# Altium project control proj.PrjPcb
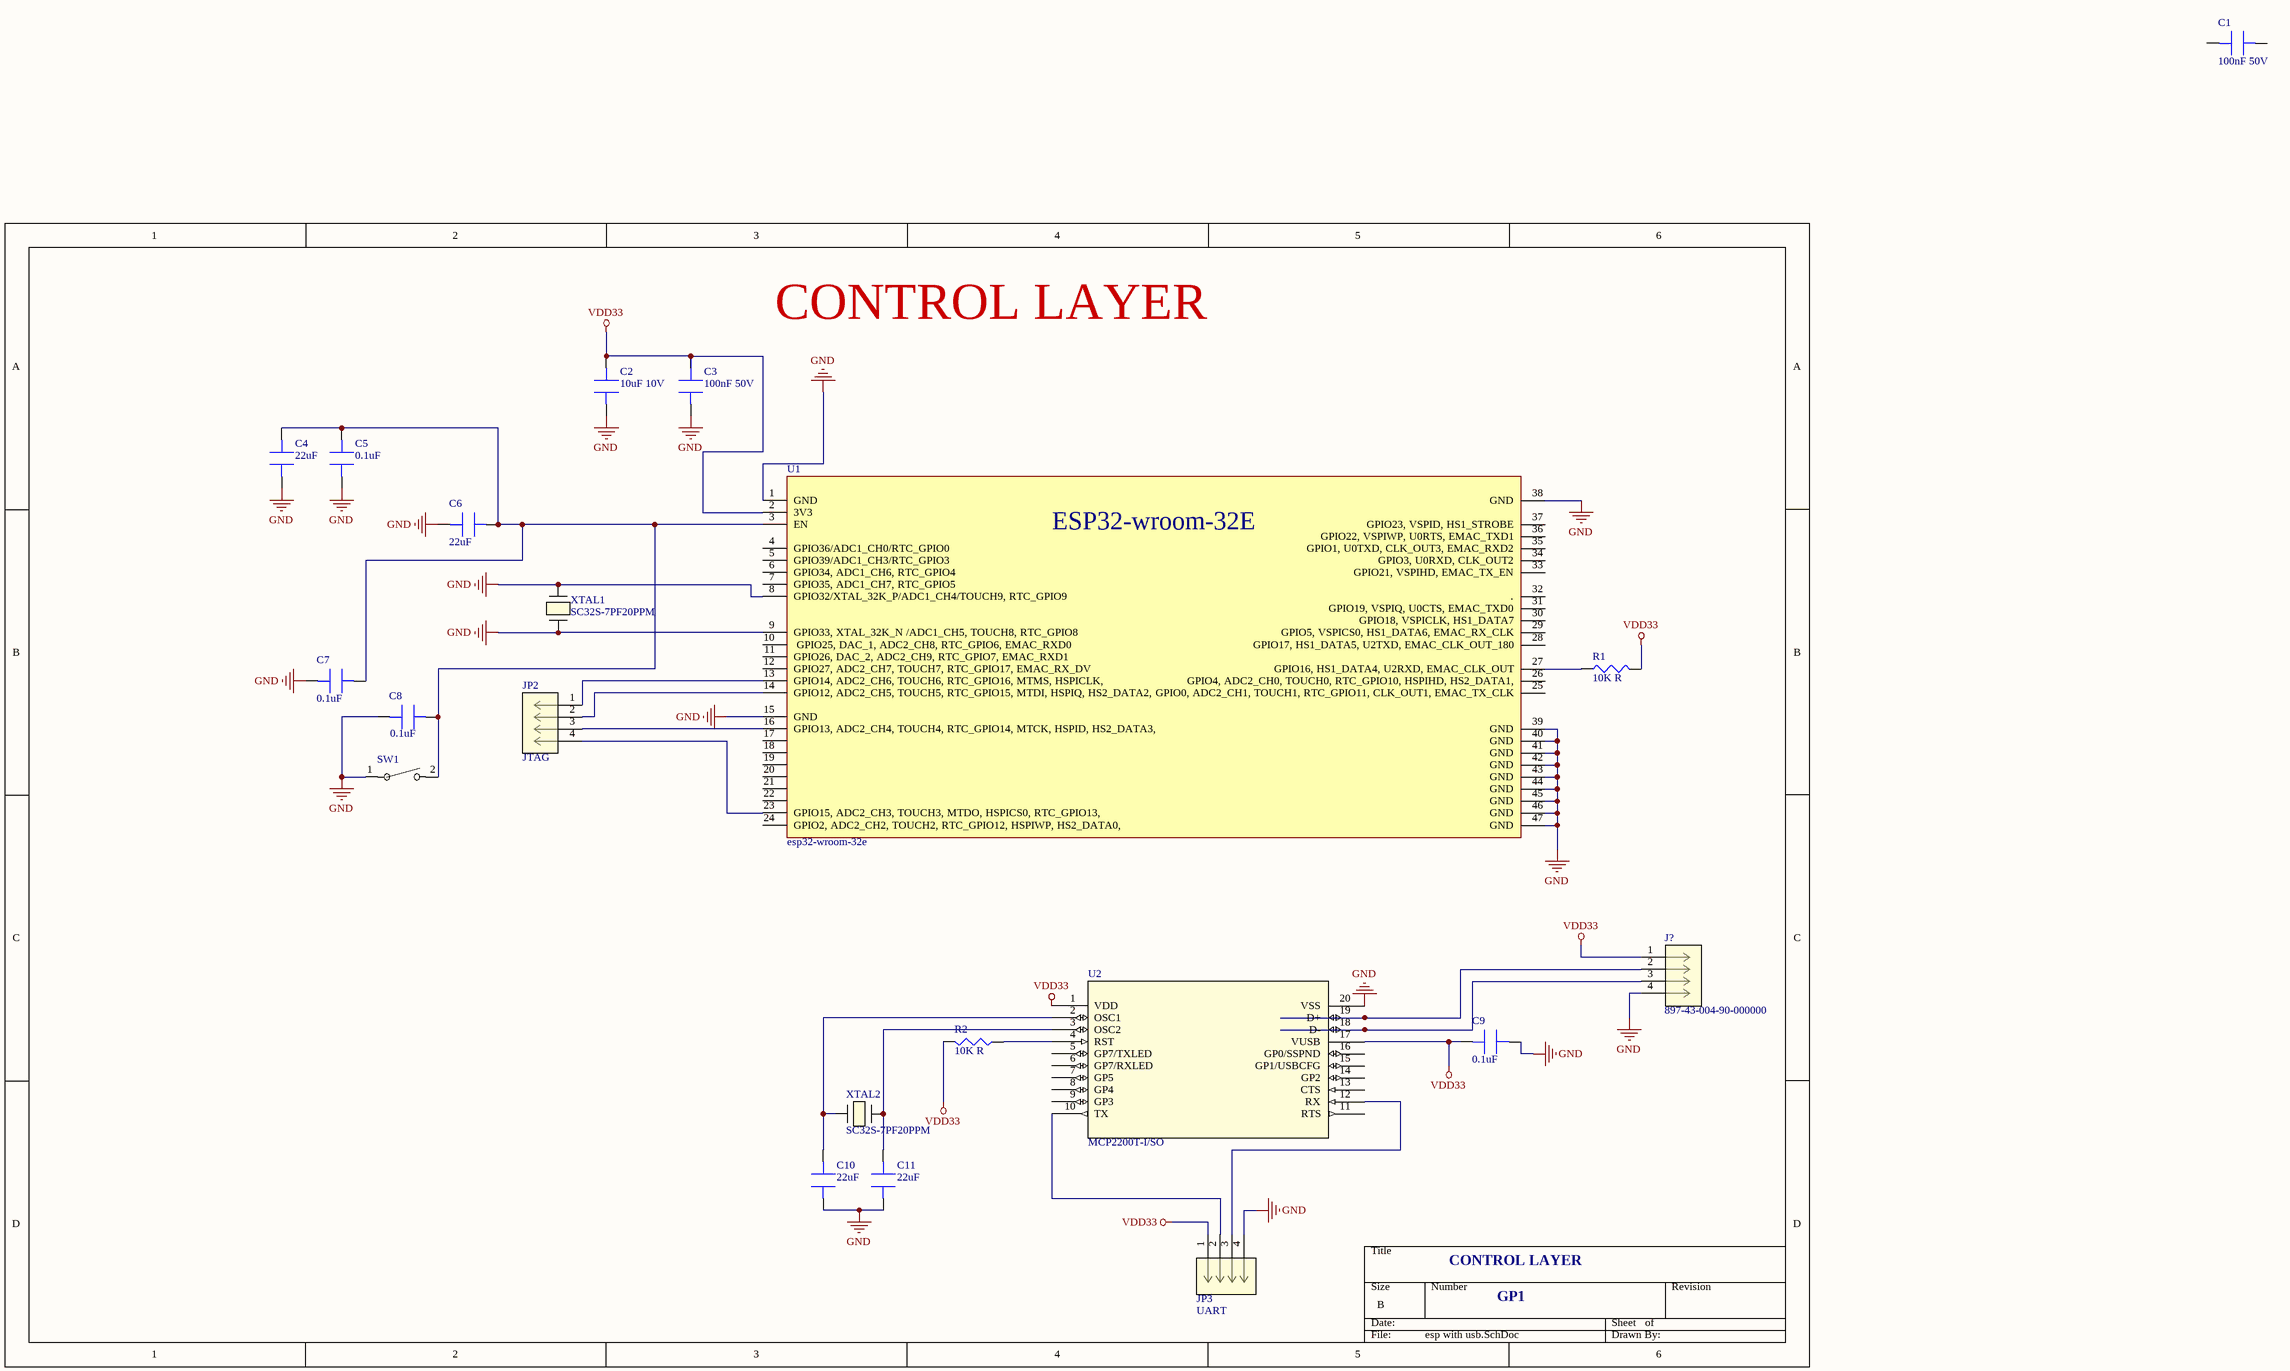
[diagram p0: esp with usb.SchDoc]
1 sheet, 21 parts. Net scope: global (net labels, ports and power ports of the same name join across sheets).
Board file: PCB1-esp with usb.PcbDoc

## Sheet esp with usb.SchDoc
size B; SheetNumber: 1; SheetTotal: 1

### Parts
C1  100nF 50V
C2  10uF 10V
C3  100nF 50V
C4  22uF  [PCBComponent_1]
C5  0.1uF
C6  22uF  [PCBComponent_1]
C7  0.1uF
C8  0.1uF
C9  0.1uF
C10  22uF  [PCBComponent_1]
C11  22uF  [PCBComponent_1]
J?  897-43-004-90-000000  [CONN_897-43-004-90-000000_MIM]
JP2  JTAG  [CONN_2078430004-SD_04_MOL]
JP3  UART  [CONN_2078430004-SD_04_MOL]
R1  10K R  [R0805]
R2  10K R  [R0805]
SW1  MDPSLFS  [SW_MDPSLFS_CNK]  (value not drawn)
U1  esp32-wroom-32e
U2  MCP2200T-I/SO  [SOIC20_SO_MCH]
XTAL1  SC32S-7PF20PPM  [XTAL_SC32S-7PF20PPM_EPS]
XTAL2  SC32S-7PF20PPM  [XTAL_SC32S-7PF20PPM_EPS]

### Nets
GND: C2.1 C3.1 C4.1 C5.1 C6.1 C7.1 C8.1 C9.1 C10.1 C11.1 J?.4 JP3.4 SW1.1 U1.1(GND) U1.8(GPIO32/XTAL_32K_P/ADC1_CH4/TOUCH9,_RTC_GPIO9) U1.9(GPIO33,_XTAL_32K_N_/ADC1_CH5,_TOUCH8,_RTC_GPIO8) U1.15(GND) U1.38(GND) U1.39(GND) U1.40(GND) U1.41(GND) U1.42(GND) U1.43(GND) U1.44(GND) U1.45(GND) U1.46(GND) U1.47(GND) U2.20(VSS) XTAL1.1 XTAL1.2
VDD33: C2.2 C3.2 C9.2 J?.1 JP3.1 R1.2 R2.2 U1.2(3V3) U2.1(VDD) U2.17(VUSB)
NetC4_2: C4.2 C5.2 C6.2 C7.2 C8.2 SW1.2 U1.3(EN)
NetC10_2: C10.2 U2.2(OSC1) XTAL2.2
NetC11_2: C11.2 U2.3(OSC2) XTAL2.1
NetJ?_2: J?.2 U2.19(D+)
NetJ?_3: J?.3 U2.18(D-)
NetJP2_1: JP2.1 U1.13(GPIO14,_ADC2_CH6,_TOUCH6,_RTC_GPIO16,_MTMS,_HSPICLK,)
NetJP2_2: JP2.2 U1.14(GPIO12,_ADC2_CH5,_TOUCH5,_RTC_GPIO15,_MTDI,_HSPIQ,_HS2_DATA2,)
NetJP2_3: JP2.3 U1.16(GPIO13,_ADC2_CH4,_TOUCH4,_RTC_GPIO14,_MTCK,_HSPID,_HS2_DATA3,)
NetJP2_4: JP2.4 U1.23(GPIO15,_ADC2_CH3,_TOUCH3,_MTDO,_HSPICS0,_RTC_GPIO13,)
NetJP3_2: JP3.2 U2.10(TX)
NetJP3_3: JP3.3 U2.12(RX)
NetR1_1: R1.1 U1.27(GPIO16,_HS1_DATA4,_U2RXD,_EMAC_CLK_OUT)
NetR2_1: R2.1 U2.4(RST)

Not connected (* = marked no-connect by the designer): C1 1 2; U1 4(GPIO36/ADC1_CH0/RTC_GPIO0) 5(GPIO39/ADC1_CH3/RTC_GPIO3) 6(GPIO34,_ADC1_CH6,_RTC_GPIO4) 7(GPIO35,_ADC1_CH7,_RTC_GPIO5) 10(_GPIO25,_DAC_1,_ADC2_CH8,_RTC_GPIO6,_EMAC_RXD0) 11(GPIO26,_DAC_2,_ADC2_CH9,_RTC_GPIO7,_EMAC_RXD1) 12(GPIO27,_ADC2_CH7,_TOUCH7,_RTC_GPIO17,_EMAC_RX_DV) 17 18 19 20 21 22 24(GPIO2,_ADC2_CH2,_TOUCH2,_RTC_GPIO12,_HSPIWP,_HS2_DATA0,) 25(GPIO0,_ADC2_CH1,_TOUCH1,_RTC_GPIO11,_CLK_OUT1,_EMAC_TX_CLK) 26(GPIO4,_ADC2_CH0,_TOUCH0,_RTC_GPIO10,_HSPIHD,_HS2_DATA1,) 28(GPIO17,_HS1_DATA5,_U2TXD,_EMAC_CLK_OUT_180) 29(GPIO5,_VSPICS0,_HS1_DATA6,_EMAC_RX_CLK) 30(GPIO18,_VSPICLK,_HS1_DATA7) 31(GPIO19,_VSPIQ,_U0CTS,_EMAC_TXD0) 32(.) 33(GPIO21,_VSPIHD,_EMAC_TX_EN) 34(GPIO3,_U0RXD,_CLK_OUT2) 35(GPIO1,_U0TXD,_CLK_OUT3,_EMAC_RXD2) 36(GPIO22,_VSPIWP,_U0RTS,_EMAC_TXD1) 37(GPIO23,_VSPID,_HS1_STROBE); U2 5(GP7/TXLED) 6(GP7/RXLED) 7(GP5) 8(GP4) 9(GP3) 11(RTS) 13(CTS) 14(GP2) 15(GP1/USBCFG) 16(GP0/SSPND)

### Notes on the sheet
- CONTROL LAYER
- GP1
- (in symbol ESP32-WROOM-32E-N8) ESP32-wroom-32E

### Library data of the parts
C1 C3 = CL05B104KB54PNC: 50V 100nF X7R ±10% 0402 Multilayer Ceramic Capacitors MLCC - SMD/SMT ROHS; Manufacturer: Samsung Electro-Mechanics; ESC PART NUMBER: C307331; Supplier: Avnet; Supplier Part Number: CL05B104KB54PNC; Manufacturer Part Number: CL05B104KB54PNC; RoHS: Compliant; Category: Ceramic Capacitors; Stock: 50000; Pricing: 10000=0.00505, 20000=0.00502, 40000=0.005, 60000=0.00497, 80000=0.00494 (USD); Value: 100nF; Case/Package: 0402; China RoHS: Compliant; Dielectric Material: Ceramic; Height: 500µm; Length: 1mm; Lifecycle Status: Production; Material: Ceramic; Max Operating Temperature: 125°C; Min Operating Temperature: -55°C; Mounting Technology: Surface Mount; Number of Terminals: 2; REACH SVHC: Yes; Schedule B: 8532240020, 8532240020|8532240020|8532240020|8532240020|8532240020|8532240020|8532240020|8532240020|8532240020|8532240020|8532240020|8532240020|8532240020|8532240020|8532240020|8532240020|8532240020|8532240020|8532240020|8532240020|8532240020|8532240020|8532240020|85; Tolerance: 10%; Voltage Rating: 50V; Voltage Rating (DC): 50V; Width: 500µm; ComponentLink1URL: https://datasheet.octopart.com:443/CL05B104KB54PNC-Samsung-Electro-Mechanics-datasheet-182018727.pdf?src-supplier=IHS; ComponentLink1Description: https://datasheet.octopart.com:443/CL05B104KB54PNC-Samsung-Electro-Mechanics-datasheet-182018727.pdf?src-supplier=IHS; ComponentLink2URL: https://datasheet.octopart.com:443/CL05B104KB54PNC-Samsung-Electro-Mechanics-datasheet-138685816.pdf?src-supplier=Samsung+SCT; ComponentLink2Description: https://datasheet.octopart.com:443/CL05B104KB54PNC-Samsung-Electro-Mechanics-datasheet-138685816.pdf?src-supplier=Samsung+SCT; ComponentLink3URL: https://datasheet.octopart.com:443/CL05B104KB54PNC-Samsung-datasheet-8326407.pdf?src-supplier=TME; ComponentLink3Description: https://datasheet.octopart.com:443/CL05B104KB54PNC-Samsung-datasheet-8326407.pdf?src-supplier=TME
C2 = CL05B104KB54PNC (2): 50V 100nF X7R ±10% 0402 Multilayer Ceramic Capacitors MLCC - SMD/SMT ROHS; Manufacturer: Samsung Electro-Mechanics; ESC PART NUMBER: C307415; Supplier: Avnet; Supplier Part Number: CL05B104KB54PNC; Manufacturer Part Number: CL05B104KB54PNC; RoHS: Compliant; Category: Ceramic Capacitors; Stock: 50000; Pricing: 10000=0.00505, 20000=0.00502, 40000=0.005, 60000=0.00497, 80000=0.00494 (USD); Value: 100nF; Case/Package: 0402; China RoHS: Compliant; Dielectric Material: Ceramic; Height: 500µm; Length: 1mm; Lifecycle Status: Production; Material: Ceramic; Max Operating Temperature: 125°C; Min Operating Temperature: -55°C; Mounting Technology: Surface Mount; Number of Terminals: 2; REACH SVHC: Yes; Schedule B: 8532240020, 8532240020|8532240020|8532240020|8532240020|8532240020|8532240020|8532240020|8532240020|8532240020|8532240020|8532240020|8532240020|8532240020|8532240020|8532240020|8532240020|8532240020|8532240020|8532240020|8532240020|8532240020|8532240020|8532240020|85; Tolerance: 10%; Voltage Rating: 50V; Voltage Rating (DC): 50V; Width: 500µm; ComponentLink1URL: https://datasheet.octopart.com:443/CL05B104KB54PNC-Samsung-Electro-Mechanics-datasheet-182018727.pdf?src-supplier=IHS; ComponentLink1Description: https://datasheet.octopart.com:443/CL05B104KB54PNC-Samsung-Electro-Mechanics-datasheet-182018727.pdf?src-supplier=IHS; ComponentLink2URL: https://datasheet.octopart.com:443/CL05B104KB54PNC-Samsung-Electro-Mechanics-datasheet-138685816.pdf?src-supplier=Samsung+SCT; ComponentLink2Description: https://datasheet.octopart.com:443/CL05B104KB54PNC-Samsung-Electro-Mechanics-datasheet-138685816.pdf?src-supplier=Samsung+SCT; ComponentLink3URL: https://datasheet.octopart.com:443/CL05B104KB54PNC-Samsung-datasheet-8326407.pdf?src-supplier=TME; ComponentLink3Description: https://datasheet.octopart.com:443/CL05B104KB54PNC-Samsung-datasheet-8326407.pdf?src-supplier=TME
C4 C10 C11 = CAP22UF
C5 C7-C9 = CL05A104KA5NNNC: 25V 100nF X5R ±10% 0402 Multilayer Ceramic Capacitors MLCC - SMD/SMT ROHS; Manufacturer: Samsung Electro-Mechanics; Supplier: Avnet; Supplier Part Number: CL05A104KA5NNNC; Manufacturer Part Number: CL05A104KA5NNNC; RoHS: Compliant; Category: Ceramic Capacitors; Stock: 6250000; Pricing: 10000=0.00127, 20000=0.00127, 40000=0.00126, 60000=0.00126, 80000=0.00125 (USD); Value: 100nF; Case/Package: 0402; Case Code (Imperial): 0402; Case Code (Metric): 1005; China RoHS: Compliant; Depth: 500µm; Dielectric: X5R; Dielectric Material: Ceramic; Height: 500µm; Lead Free: Lead Free; Length: 1mm; Lifecycle Status: Production; Material: Ceramic; Max Operating Temperature: 85°C; Min Operating Temperature: -55°C; Mounting Technology: Surface Mount; Number of Terminals: 2; Radiation Hardening: No; REACH SVHC: Yes; Schedule B: 8532240020, 8532240020|8532240020|8532240020|8532240020|8532240020|8532240020|8532240020|8532240020|8532240020|8532240020|8532240020|8532240020|8532240020|8532240020|8532240020|8532240020|8532240020|8532240020|8532240020|8532240020|8532240020|8532240020|8532240020|85; Thickness: 558.8µm; Tolerance: 10%; Voltage: 25V; Voltage Rating: 25V; Voltage Rating (DC): 25V; Width: 500µm; ComponentLink1URL: https://datasheet.octopart.com:443/CL05A104KA5NNNC-Samsung-Electro-Mechanics-datasheet-181960513.pdf?src-supplier=Newark; ComponentLink1Description: https://datasheet.octopart.com:443/CL05A104KA5NNNC-Samsung-Electro-Mechanics-datasheet-181960513.pdf?src-supplier=Newark; ComponentLink2URL: https://datasheet.octopart.com:443/CL05A104KA5NNNC-Samsung-Electro-Mechanics-datasheet-136031715.pdf?src-supplier=Samsung+SCT; ComponentLink2Description: https://datasheet.octopart.com:443/CL05A104KA5NNNC-Samsung-Electro-Mechanics-datasheet-136031715.pdf?src-supplier=Samsung+SCT; ComponentLink3URL: https://datasheet.octopart.com:443/CL05A104KA5NNNC-Samsung-Electro-Mechanics-datasheet-110226196.pdf?src-supplier=Future+Electronics; ComponentLink3Description: https://datasheet.octopart.com:443/CL05A104KA5NNNC-Samsung-Electro-Mechanics-datasheet-110226196.pdf?src-supplier=Future+Electronics; ComponentLink4URL: https://datasheet.octopart.com:443/CL05A104KA5NNNC-Samsung-Electro-Mechanics-datasheet-81461585.pdf?src-supplier=Future+Electronics; ComponentLink4Description: https://datasheet.octopart.com:443/CL05A104KA5NNNC-Samsung-Electro-Mechanics-datasheet-81461585.pdf?src-supplier=Future+Electronics; ComponentLink5URL: https://datasheet.octopart.com:443/CL05A104KA5NNNC-Samsung-datasheet-42485115.pdf?src-supplier=Future+Electronics; ComponentLink5Description: https://datasheet.octopart.com:443/CL05A104KA5NNNC-Samsung-datasheet-42485115.pdf?src-supplier=Future+Electronics; ComponentLink6URL: https://datasheet.octopart.com:443/CL05A104KA5NNNC-Samsung-datasheet-26588998.pdf?src-supplier=Future+Electronics; ComponentLink6Description: https://datasheet.octopart.com:443/CL05A104KA5NNNC-Samsung-datasheet-26588998.pdf?src-supplier=Future+Electronics; ComponentLink7URL: https://datasheet.octopart.com:443/CL05A104KA5NNNC-Samsung-datasheet-12539701.pdf?src-supplier=Future+Electronics; ComponentLink7Description: https://datasheet.octopart.com:443/CL05A104KA5NNNC-Samsung-datasheet-12539701.pdf?src-supplier=Future+Electronics; ComponentLink8URL: https://datasheet.octopart.com:443/CL05A104KA5NNNC-Samsung-Electro-Mechanics-datasheet-149136628.pdf?src-supplier=Future+Electronics; ComponentLink8Description: https://datasheet.octopart.com:443/CL05A104KA5NNNC-Samsung-Electro-Mechanics-datasheet-149136628.pdf?src-supplier=Future+Electronics; ComponentLink9URL: https://datasheet.octopart.com/CL05A104KA5NNNC-Samsung-Electro-Mechanics-datasheet-97040617.pdf; ComponentLink9Description: https://datasheet.octopart.com/CL05A104KA5NNNC-Samsung-Electro-Mechanics-datasheet-97040617.pdf; ComponentLink10URL: https://datasheet.octopart.com/CL05A104KA5NNNC-Samsung-Electro-Mechanics-datasheet-8324245.pdf; ComponentLink10Description: https://datasheet.octopart.com/CL05A104KA5NNNC-Samsung-Electro-Mechanics-datasheet-8324245.pdf; ComponentLink11URL: https://datasheet.octopart.com/General-Multilayer-Ceramic-Capacitors-Samsung-datasheet-family-111.pdf; ComponentLink11Description: https://datasheet.octopart.com/General-Multilayer-Ceramic-Capacitors-Samsung-datasheet-family-111.pdf; ComponentLink12URL: https://datasheet.octopart.com:443/CL05A104KA5NNNC-Samsung-Electro-Mechanics-datasheet-11550168.pdf?src-supplier=Arrow+Electronics; ComponentLink12Description: https://datasheet.octopart.com:443/CL05A104KA5NNNC-Samsung-Electro-Mechanics-datasheet-11550168.pdf?src-supplier=Arrow+Electronics; ComponentLink13URL: https://datasheet.octopart.com:443/CL05A104KA5NNNC-Samsung-datasheet-59220082.pdf?src-supplier=TME; ComponentLink13Description: https://datasheet.octopart.com:443/CL05A104KA5NNNC-Samsung-datasheet-59220082.pdf?src-supplier=TME; ComponentLink14URL: http://sigma.octopart.com:80/rohs_certificate/General-Multilayer-Ceramic-Capacitors-Samsung-family-110.pdf?src-supplier=Compliance+Statements; ComponentLink14Description: http://sigma.octopart.com:80/rohs_certificate/General-Multilayer-Ceramic-Capacitors-Samsung-family-110.pdf?src-supplier=Compliance+Statements; ComponentLink15URL: http://sigma.octopart.com:80/rohs_statement/General-Multilayer-Ceramic-Capacitors-Samsung-family-132.pdf?src-supplier=Compliance+Statements; ComponentLink15Description: http://sigma.octopart.com:80/rohs_statement/General-Multilayer-Ceramic-Capacitors-Samsung-family-132.pdf?src-supplier=Compliance+Statements; ComponentLink16URL: http://sigma.octopart.com:80/reach_statement/General-Multilayer-Ceramic-Capacitors-Samsung-family-133.pdf?src-supplier=Compliance+Statements; ComponentLink16Description: http://sigma.octopart.com:80/reach_statement/General-Multilayer-Ceramic-Capacitors-Samsung-family-133.pdf?src-supplier=Compliance+Statements; LCSC PART NUMBER: *
C6 = CAP22pF
J? = 897-43-004-90-000000: No Description Available; Manufacturer_Name: Mill-Max; Copyright: Copyright (C) 2025 Ultra Librarian. All rights reserved.; Manufacturer_Part_Number: 897-43-004-90-000000; RefDes: RefDes; Type: Type
JP2 JP3 = 2078430004: KK Plus 250 Header, 2.50mm Pitch, Vertical, Fully Shrouded, Tin (Sn) Plating, 4 Circuits, with Peg, Glow-Wire Capable; Manufacturer_Name: Molex Connector Corporation; Copyright: Copyright (C) 2025 Ultra Librarian. All rights reserved.; Manufacturer_Part_Number: 2078430004; RefDes: RefDes; Type: Type
R1 R2 = RESSS
SW1 = MDPSLFS: Description; Manufacturer_Name: C&K Components; Type: Pushbutton Switches; Copyright: Copyright (C) 2025 Ultra Librarian. All rights reserved.; Manufacturer_Part_Number: MDPSLFS
U1 = ESP32-WROOM-32E-N8: SMD module, ESP32-D0WD-V3, ESP32 ECO V3, 8 MB SPI flash, PCB antenna; Manufacturer: Espressif Systems; Max Supply Voltage: 3.6V; Min Supply Voltage: 3V; Operating Supply Voltage: 3.3V; Supplier: DigiKey; Supplier Part Number: 5407-ESP32-WROOM-32E-N8CT-ND; Manufacturer Part Number: ESP32-WROOM-32E-N8; RoHS: Compliant; Category: System on Chip (SoC); Stock: 5737; Pricing: 1=5.28, 10=4.566, 25=4.3196, 100=3.9802, 250=3.7768 (USD); Height - Seated (Max): 3.25mm; Length: 25.5mm; Max Operating Temperature: 85°C; Min Operating Temperature: -40°C; Number of Terminals: 38; REACH SVHC: Yes; Terminal Pitch: 1.27mm; Width: 18mm; ComponentLink1URL: https://datasheet.octopart.com:443/ESP32-WROOM-32E-N8-Espressif-Systems-datasheet-182247776.pdf?src-supplier=IHS; ComponentLink1Description: https://datasheet.octopart.com:443/ESP32-WROOM-32E-N8-Espressif-Systems-datasheet-182247776.pdf?src-supplier=IHS; ComponentLink2URL: https://datasheet.octopart.com:443/ESP32-WROOM-32E-N8-Espressif-Systems-datasheet-188867343.pdf?src-supplier=TME; ComponentLink2Description: https://datasheet.octopart.com:443/ESP32-WROOM-32E-N8-Espressif-Systems-datasheet-188867343.pdf?src-supplier=TME; ComponentLink3URL: https://datasheet.octopart.com:443/ESP32-WROOM-32E-N8-Espressif-Systems-datasheet-165560559.pdf?src-supplier=TME; ComponentLink3Description: https://datasheet.octopart.com:443/ESP32-WROOM-32E-N8-Espressif-Systems-datasheet-165560559.pdf?src-supplier=TME; ComponentLink4URL: https://datasheet.octopart.com:443/ESP32-WROOM-32E-N8-Espressif-Systems-datasheet-176782711.pdf?src-supplier=SOS+electronic; ComponentLink4Description: https://datasheet.octopart.com:443/ESP32-WROOM-32E-N8-Espressif-Systems-datasheet-176782711.pdf?src-supplier=SOS+electronic; LCSC PART NUMBER: C701342
U2 = MCP2200T-ISO: No Description Available; Manufacturer_Name: Microchip; Copyright: Copyright (C) 2025 Ultra Librarian. All rights reserved.; Manufacturer_Part_Number: MCP2200T-I/SO; RefDes: RefDes; Type: Type
XTAL1 XTAL2 = SC32S-7PF20PPM: Description; Manufacturer_Name: Epson; Copyright: Copyright (C) 2025 Ultra Librarian. All rights reserved.; Manufacturer_Part_Number: SC32S-7PF20PPM